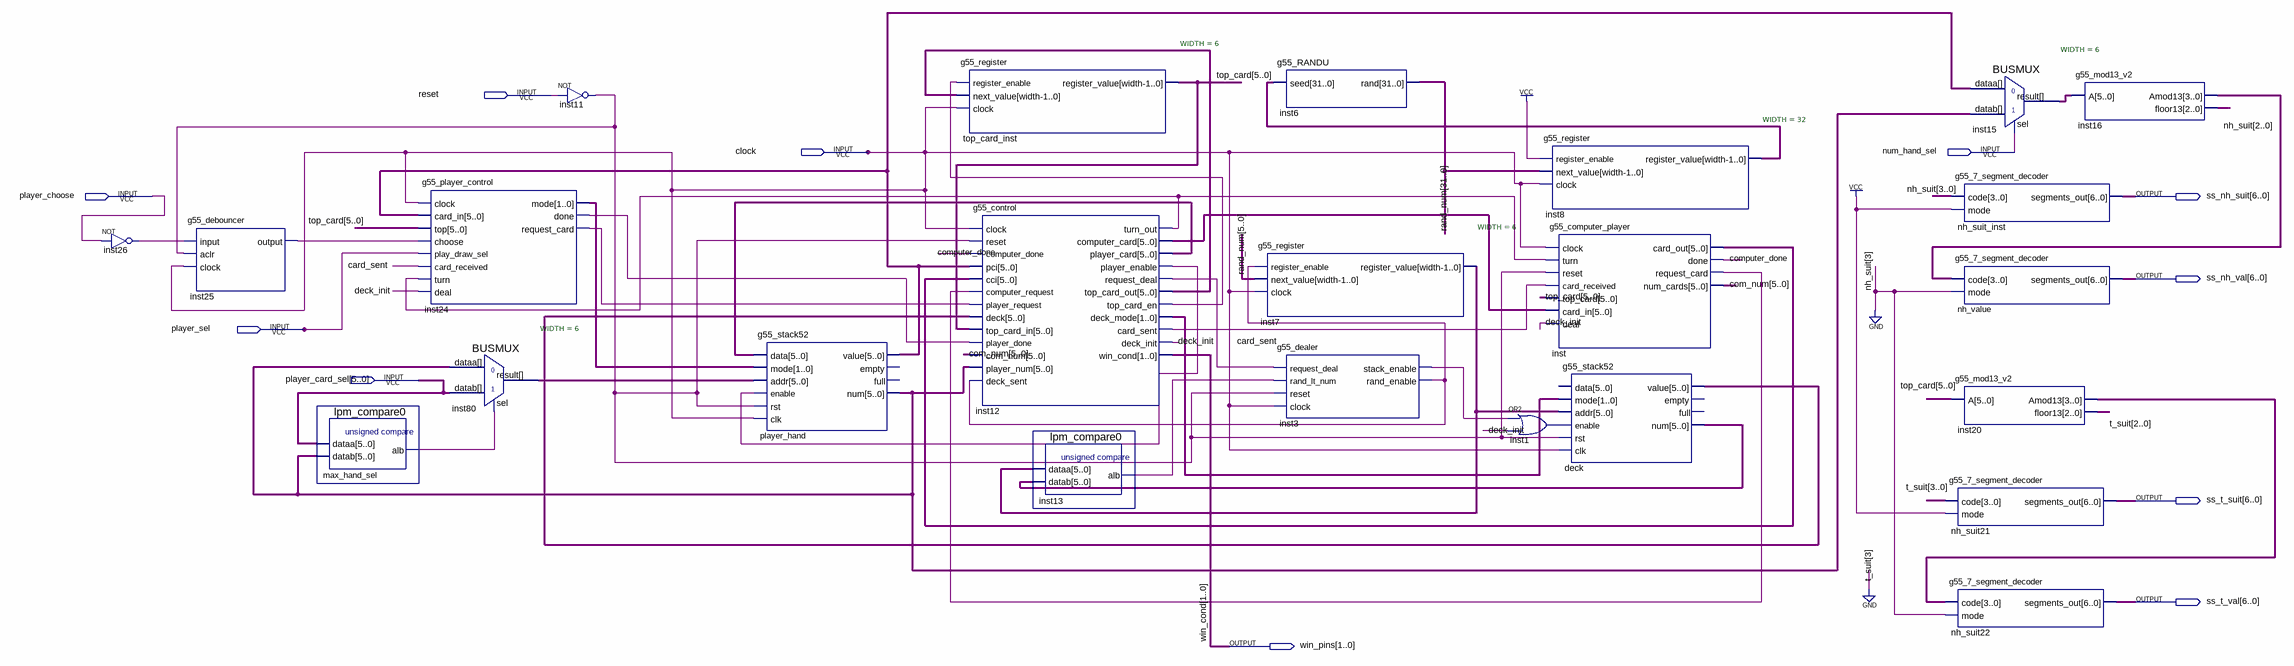
[diagram p0: schematic sheet]
// Quartus schematic g55_system.bdf as structural Verilog: 24 symbols, 11 pins
module g55_system (
  input  reset,
  input  clock,
  input  num_hand_sel,
  input  player_choose,
  input  player_sel,
  input  [5:0] player_card_sel,
  output [6:0] ss_nh_suit,
  output [6:0] ss_nh_val,
  output [6:0] ss_t_suit,
  output [6:0] ss_t_val,
  output [1:0] win_pins
);

  wire card_sent, computer_done, deck_init, inst1_out, inst3_rand_enable, inst3_stack_enable, inst11_out,
       inst12_player_enable, inst12_request_deal, inst12_top_card_en, inst12_turn_out, inst13_alb,
       inst24_done, inst24_request_card, inst25_output, inst26_out, inst_request_card, max_hand_sel_alb;
  wire [1:0] inst12_deck_mode, inst24_mode;
  wire [2:0] nh_suit, t_suit;
  wire [3:0] inst16_amod13, inst20_amod13;
  wire [5:0] com_num, deck_num, deck_value, inst7_register_value, inst12_computer_card, inst12_player_card,
       inst12_top_card_out, inst15_result, inst80_result, inst_card_out, player_hand_num, player_hand_value,
       top_card;
  wire [31:0] inst8_register_value, rand_num;

  not inst26 (inst26_out, player_choose);
  g55_debouncer inst25 (.\input (inst26_out), .aclr(inst11_out), .clock(clock), .\output (inst25_output));
  lpm_compare0 max_hand_sel (.dataa(player_card_sel), .datab(player_hand_num), .alb(max_hand_sel_alb));
  g55_player_control inst24 (
    .clock(clock), .card_in(player_hand_value), .top(top_card), .choose(inst25_output),
    .play_draw_sel(player_sel), .card_received(card_sent), .turn(inst12_turn_out), .deal(deck_init),
    .mode(inst24_mode), .done(inst24_done), .request_card(inst24_request_card));
  BUSMUX #(.WIDTH(6)) inst80 (
    .datab(player_card_sel), .sel(max_hand_sel_alb), .dataa(player_hand_num), .result(inst80_result));
  not inst11 (inst11_out, reset);
  g55_stack52 player_hand (
    .data(inst12_player_card), .mode(inst24_mode), .addr(inst80_result), .enable(inst12_player_enable),
    .rst(inst11_out), .clk(clock), .value(player_hand_value), .num(player_hand_num));  // open: empty, full
  g55_register #(.WIDTH(6)) top_card_inst (
    .register_enable(inst12_top_card_en), .next_value(inst12_top_card_out), .clock(clock),
    .register_value(top_card));
  g55_control inst12 (
    .clock(clock), .reset(inst11_out), .computer_done(computer_done), .pci(player_hand_value),
    .cci(inst_card_out), .computer_request(inst_request_card), .player_request(inst24_request_card),
    .deck(deck_value), .top_card_in(top_card), .player_done(inst24_done), .com_num(com_num),
    .player_num(player_hand_num), .deck_sent(inst3_rand_enable), .turn_out(inst12_turn_out),
    .computer_card(inst12_computer_card), .player_card(inst12_player_card),
    .player_enable(inst12_player_enable), .request_deal(inst12_request_deal),
    .top_card_out(inst12_top_card_out), .top_card_en(inst12_top_card_en), .deck_mode(inst12_deck_mode),
    .card_sent(card_sent), .deck_init(deck_init), .win_cond(win_pins));
  lpm_compare0 inst13 (.dataa(inst7_register_value), .datab(deck_num), .alb(inst13_alb));
  g55_RANDU inst6 (.seed(inst8_register_value), .\rand (rand_num));
  g55_register #(.WIDTH(6)) inst7 (
    .register_enable(inst3_rand_enable), .next_value(rand_num[5:0]), .clock(clock),
    .register_value(inst7_register_value));
  g55_dealer inst3 (
    .request_deal(inst12_request_deal), .rand_lt_num(inst13_alb), .reset(inst11_out), .clock(clock),
    .stack_enable(inst3_stack_enable), .rand_enable(inst3_rand_enable));
  or inst1 (inst1_out, inst3_stack_enable, deck_init);
  g55_register #(.WIDTH(32)) inst8 (
    .register_enable(1'b1), .next_value(rand_num), .clock(clock), .register_value(inst8_register_value));
  g55_computer_player inst (
    .clock(clock), .turn(inst12_turn_out), .reset(inst11_out), .card_received(card_sent),
    .top_card(top_card), .card_in(inst12_computer_card), .deal(deck_init), .card_out(inst_card_out),
    .done(computer_done), .request_card(inst_request_card), .num_cards(com_num));
  g55_stack52 deck (
    .mode(inst12_deck_mode), .addr(inst7_register_value), .enable(inst1_out), .rst(inst11_out), .clk(clock),
    .value(deck_value), .num(deck_num));  // open: data, empty, full
  BUSMUX #(.WIDTH(6)) inst15 (
    .datab(player_hand_num), .sel(num_hand_sel), .dataa(player_hand_value), .result(inst15_result));
  g55_7_segment_decoder nh_suit_inst (.code({1'b0, nh_suit}), .mode(1'b1), .segments_out(ss_nh_suit));
  g55_7_segment_decoder nh_value (.code(inst16_amod13), .mode(1'b0), .segments_out(ss_nh_val));
  g55_mod13_v2 inst20 (.A(top_card), .Amod13(inst20_amod13), .floor13(t_suit));
  g55_7_segment_decoder nh_suit21 (.code({1'b0, t_suit}), .mode(1'b1), .segments_out(ss_t_suit));
  g55_7_segment_decoder nh_suit22 (.code(inst20_amod13), .mode(1'b0), .segments_out(ss_t_val));
  g55_mod13_v2 inst16 (.A(inst15_result), .Amod13(inst16_amod13), .floor13(nh_suit));

  // Other names for the same wires on the sheet: win_cond[1:0] = win_pins
endmodule
